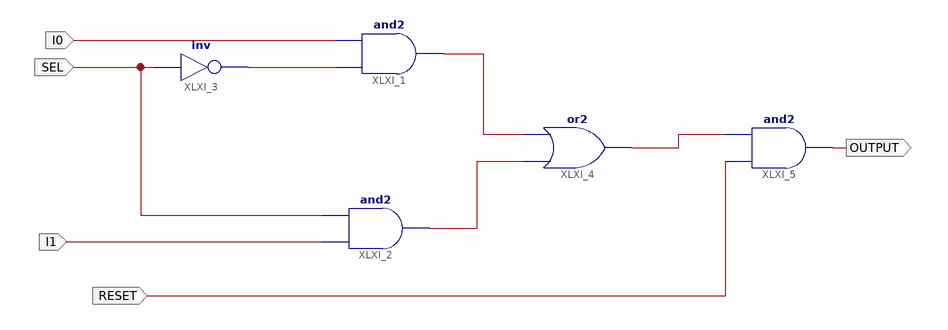
[diagram p0: schematic sheet 1]
// Xilinx ISE schematic Two_to_One_MUX.sch (spartan6) as structural Verilog: 5 symbols, 5 ports
module Two_to_One_MUX (
  input  RESET,
  input  I0,
  input  SEL,
  input  I1,
  output OUTPUT
);

  wire XLXN_1, XLXN_2, XLXN_3, XLXN_5;

  and XLXI_1 (XLXN_1, XLXN_5, I0);
  and XLXI_2 (XLXN_2, I1, SEL);
  not XLXI_3 (XLXN_5, SEL);
  or XLXI_4 (XLXN_3, XLXN_2, XLXN_1);
  and XLXI_5 (OUTPUT, RESET, XLXN_3);
endmodule
